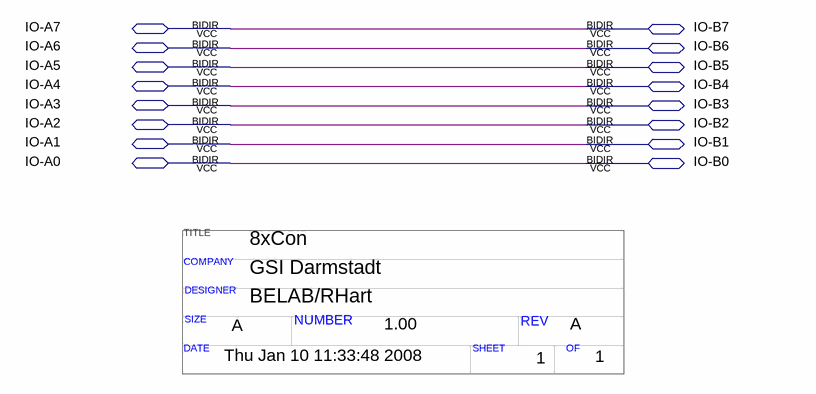
[diagram p0: schematic sheet]
// Quartus schematic 8xCon.bdf as structural Verilog: 0 symbols, 16 pins
// Title block: TITLE: 8xCon; COMPANY: GSI Darmstadt; DESIGNER: BELAB/RHart; SIZE: A; NUMBER: 1.00; REV: A; DATE: Thu Jan 10 11:33:48 2008; SHEET: 1; OF: 1
module \8xCon  (
  inout  \IO-A7 ,
  inout  \IO-B7 ,
  inout  \IO-A6 ,
  inout  \IO-B6 ,
  inout  \IO-A5 ,
  inout  \IO-B5 ,
  inout  \IO-A4 ,
  inout  \IO-B4 ,
  inout  \IO-A3 ,
  inout  \IO-B3 ,
  inout  \IO-A2 ,
  inout  \IO-B2 ,
  inout  \IO-A1 ,
  inout  \IO-B1 ,
  inout  \IO-A0 ,
  inout  \IO-B0 
);


  assign \IO-B0  = \IO-A0 ;
  assign \IO-B1  = \IO-A1 ;
  assign \IO-B2  = \IO-A2 ;
  assign \IO-B3  = \IO-A3 ;
  assign \IO-B4  = \IO-A4 ;
  assign \IO-B5  = \IO-A5 ;
  assign \IO-B6  = \IO-A6 ;
  assign \IO-B7  = \IO-A7 ;
endmodule
